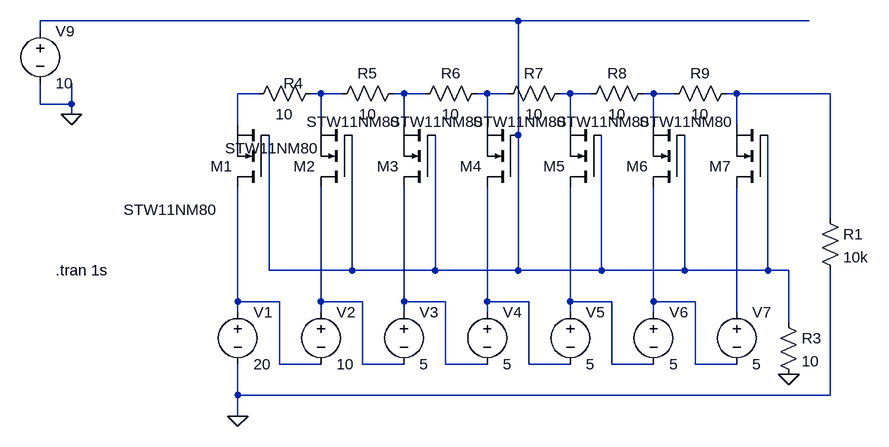
[diagram p0: schematic keyboard-varistor.asc]
keyboard-varistor.asc, the LTspice schematic file:
Version 4
SHEET 1 1388 680
WIRE 288 -64 -448 -64
WIRE 736 -64 288 -64
WIRE -448 -48 -448 -64
WIRE -112 48 -144 48
WIRE -16 48 -32 48
WIRE 16 48 -16 48
WIRE 112 48 96 48
WIRE 144 48 112 48
WIRE 240 48 224 48
WIRE 272 48 240 48
WIRE 368 48 352 48
WIRE 400 48 368 48
WIRE 496 48 480 48
WIRE 528 48 496 48
WIRE 624 48 608 48
WIRE 768 48 624 48
WIRE -448 64 -448 32
WIRE -400 64 -400 32
WIRE -400 64 -448 64
WIRE -400 80 -400 64
WIRE -144 96 -144 48
WIRE -16 96 -16 48
WIRE 112 96 112 48
WIRE 240 96 240 48
WIRE 368 96 368 48
WIRE 496 96 496 48
WIRE 624 96 624 48
WIRE 288 112 288 -64
WIRE 768 240 768 48
WIRE -96 320 -96 112
WIRE 32 320 32 112
WIRE 32 320 -96 320
WIRE 160 320 160 112
WIRE 160 320 32 320
WIRE 288 320 288 112
WIRE 288 320 160 320
WIRE 416 320 416 112
WIRE 416 320 288 320
WIRE 544 320 544 112
WIRE 544 320 416 320
WIRE 672 320 672 112
WIRE 672 320 544 320
WIRE 704 320 672 320
WIRE -144 368 -144 192
WIRE -80 368 -144 368
WIRE -16 368 -16 192
WIRE 48 368 -16 368
WIRE 112 368 112 192
WIRE 176 368 112 368
WIRE 240 368 240 192
WIRE 304 368 240 368
WIRE 368 368 368 192
WIRE 432 368 368 368
WIRE 496 368 496 192
WIRE 560 368 496 368
WIRE -144 384 -144 368
WIRE -16 384 -16 368
WIRE 112 384 112 368
WIRE 240 384 240 368
WIRE 368 384 368 368
WIRE 496 384 496 368
WIRE 624 384 624 192
WIRE 704 400 704 320
WIRE -80 464 -80 368
WIRE -16 464 -80 464
WIRE 48 464 48 368
WIRE 112 464 48 464
WIRE 176 464 176 368
WIRE 240 464 176 464
WIRE 304 464 304 368
WIRE 368 464 304 464
WIRE 432 464 432 368
WIRE 496 464 432 464
WIRE 560 464 560 368
WIRE 624 464 560 464
WIRE -144 512 -144 464
WIRE 768 512 768 320
WIRE 768 512 -144 512
WIRE -144 544 -144 512
FLAG -144 544 0
FLAG -400 80 0
FLAG 704 480 0
DATAFLAG -16 256 ""
DATAFLAG 768 128 ""
DATAFLAG -144 256 ""
DATAFLAG 112 256 ""
DATAFLAG 624 272 ""
DATAFLAG -96 -64 ""
SYMBOL voltage -144 368 R0
WINDOW 123 0 0 Left 0
WINDOW 39 0 0 Left 0
SYMATTR InstName V1
SYMATTR Value 20
SYMBOL voltage -16 368 R0
WINDOW 123 0 0 Left 0
WINDOW 39 0 0 Left 0
SYMATTR InstName V2
SYMATTR Value 10
SYMBOL voltage 112 368 R0
WINDOW 123 0 0 Left 0
WINDOW 39 0 0 Left 0
SYMATTR InstName V3
SYMATTR Value 5
SYMBOL voltage 240 368 R0
WINDOW 123 0 0 Left 0
WINDOW 39 0 0 Left 0
SYMATTR InstName V4
SYMATTR Value 5
SYMBOL voltage 368 368 R0
WINDOW 123 0 0 Left 0
WINDOW 39 0 0 Left 0
SYMATTR InstName V5
SYMATTR Value 5
SYMBOL voltage 496 368 R0
WINDOW 123 0 0 Left 0
WINDOW 39 0 0 Left 0
SYMATTR InstName V6
SYMATTR Value 5
SYMBOL voltage 624 368 R0
WINDOW 123 0 0 Left 0
WINDOW 39 0 0 Left 0
SYMATTR InstName V7
SYMATTR Value 5
SYMBOL voltage -448 -64 R0
WINDOW 123 0 0 Left 0
WINDOW 39 0 0 Left 0
SYMATTR InstName V9
SYMATTR Value 10
SYMBOL nmos -96 192 R180
WINDOW 3 79 -35 Left 2
SYMATTR InstName M1
SYMATTR Value STW11NM80
SYMBOL res 752 224 R0
SYMATTR InstName R1
SYMATTR Value 10k
SYMBOL res 688 384 R0
SYMATTR InstName R3
SYMATTR Value 10
SYMBOL res -16 32 R90
WINDOW 0 16 42 VBottom 2
WINDOW 3 32 56 VTop 2
SYMATTR InstName R4
SYMATTR Value 10
SYMBOL res 112 32 R90
WINDOW 0 0 56 VBottom 2
WINDOW 3 32 56 VTop 2
SYMATTR InstName R5
SYMATTR Value 10
SYMBOL res 240 32 R90
WINDOW 0 0 56 VBottom 2
WINDOW 3 32 56 VTop 2
SYMATTR InstName R6
SYMATTR Value 10
SYMBOL res 368 32 R90
WINDOW 0 0 56 VBottom 2
WINDOW 3 32 56 VTop 2
SYMATTR InstName R7
SYMATTR Value 10
SYMBOL res 496 32 R90
WINDOW 0 0 56 VBottom 2
WINDOW 3 32 56 VTop 2
SYMATTR InstName R8
SYMATTR Value 10
SYMBOL res 624 32 R90
WINDOW 0 0 56 VBottom 2
WINDOW 3 32 56 VTop 2
SYMATTR InstName R9
SYMATTR Value 10
SYMBOL nmos 32 192 R180
WINDOW 3 51 60 Left 2
SYMATTR InstName M2
SYMATTR Value STW11NM80
SYMBOL nmos 160 192 R180
WINDOW 3 53 101 Left 2
SYMATTR InstName M3
SYMATTR Value STW11NM80
SYMBOL nmos 288 192 R180
WINDOW 3 53 101 Left 2
SYMATTR InstName M4
SYMATTR Value STW11NM80
SYMBOL nmos 416 192 R180
WINDOW 3 53 101 Left 2
SYMATTR InstName M5
SYMATTR Value STW11NM80
SYMBOL nmos 544 192 R180
WINDOW 3 53 101 Left 2
SYMATTR InstName M6
SYMATTR Value STW11NM80
SYMBOL nmos 672 192 R180
WINDOW 3 53 101 Left 2
SYMATTR InstName M7
SYMATTR Value STW11NM80
TEXT -424 320 Left 2 !.tran 1s

The netlist it stands for:
* keyboard-varistor.asc
V1 N009 0 20
V2 N010 N009 10
V3 N011 N010 5
V4 N012 N011 5
V5 N013 N012 5
V6 N014 N013 5
V7 N015 N014 5
V9 N001 0 10
M1 N009 N001 N002 N002 STW11NM80
R1 N008 0 10k
R3 N001 0 10
R4 N003 N002 10
R5 N004 N003 10
R6 N005 N004 10
R7 N006 N005 10
R8 N007 N006 10
R9 N008 N007 10
M2 N010 N001 N003 N003 STW11NM80
M3 N011 N001 N004 N004 STW11NM80
M4 N012 N001 N005 N005 STW11NM80
M5 N013 N001 N006 N006 STW11NM80
M6 N014 N001 N007 N007 STW11NM80
M7 N015 N001 N008 N008 STW11NM80
.model NMOS NMOS
.model PMOS PMOS
.lib standard.mos
.tran 1s
.backanno
.end